# EAGLE design LPT2MIDI (EAGLE 9.5.2)
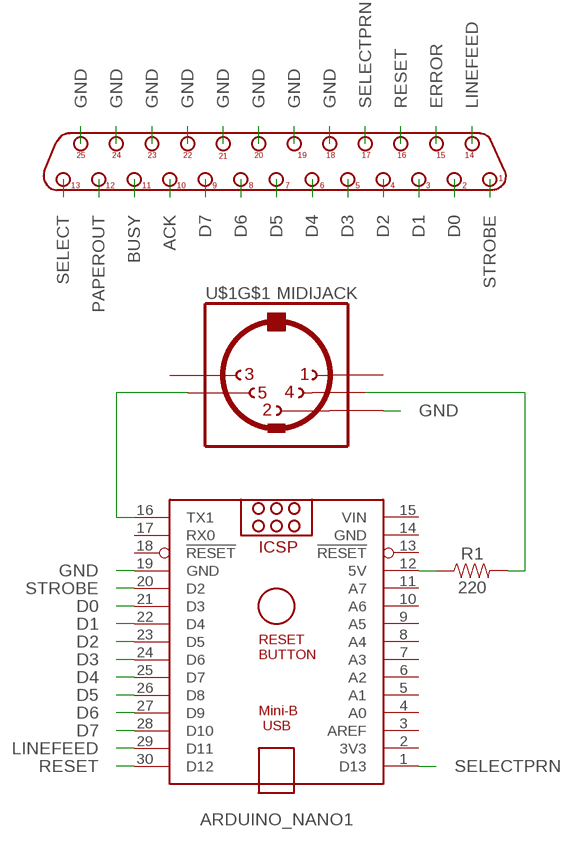
[diagram p0: schematic, sheet 1]

## Parts
ARDUINO_NANO1  ARDUINO_NANO  [ARDUINO_NANO]
CON1  DB25M/90  [D-25M/90]
R1  220  100OHM-HORIZ-1/4W-1%  [AXIAL-0.3]
U$1  MIDIJACK  [CP-2350]

## Nets
ACK: CON1.10
BUSY: CON1.11
D0: ARDUINO_NANO1.21(D3) CON1.2
D1: ARDUINO_NANO1.22(D4) CON1.3
D2: ARDUINO_NANO1.23(D5) CON1.4
D3: ARDUINO_NANO1.24(D6) CON1.5
D4: ARDUINO_NANO1.25(D7) CON1.6
D5: ARDUINO_NANO1.26(D8) CON1.7
D6: ARDUINO_NANO1.27(D9) CON1.8
D7: ARDUINO_NANO1.28(D10) CON1.9
ERROR: CON1.15
GND: ARDUINO_NANO1.19(GND) CON1.18 CON1.19 CON1.20 CON1.21 CON1.22 CON1.23 CON1.24 CON1.25 U$1.2
LINEFEED: ARDUINO_NANO1.29(D11) CON1.14
N$1: ARDUINO_NANO1.12(5V) R1.P$1
N$2: R1.P$2 U$1.4
N$3: ARDUINO_NANO1.16(TX1) U$1.5
PAPEROUT: CON1.12
RESET: ARDUINO_NANO1.30(D12) CON1.16
SELECT: CON1.13
SELECTPRN: ARDUINO_NANO1.1(D13) CON1.17
STROBE: ARDUINO_NANO1.20(D2) CON1.1
Unconnected: ARDUINO_NANO1.2(3V3) ARDUINO_NANO1.3(AREF) ARDUINO_NANO1.4(A0) ARDUINO_NANO1.5(A1) ARDUINO_NANO1.6(A2) ARDUINO_NANO1.7(A3) ARDUINO_NANO1.8(A4) ARDUINO_NANO1.9(A5) ARDUINO_NANO1.10(A6) ARDUINO_NANO1.11(A7) ARDUINO_NANO1.13(!RESET) ARDUINO_NANO1.17(RX0) ARDUINO_NANO1.18(!RESET) U$1.1 U$1.3 U$1.PE1(MT) U$1.PE2(MT) U$1.PE(MT) U$1.PE@(MT)

## Power pins joined to a net without a drawn wire
GND: ARDUINO_NANO1.14(GND)
VIN: ARDUINO_NANO1.15(VIN)

## Library data of the parts
ARDUINO_NANO1 = ArduinoNanoV30:ARDUINO_NANO: Arduino Nano V3.0 Overview: The Arduino Nano is a small, complete, and breadboard-friendly board based on the ATmega328 (Arduino Nano 3.x) or ATmega168 (Arduino Nano 2.x). It has more or less the same functionality of the Arduino Duemilanove, but in a different package. It lacks only a DC power jack, and works with a Mini-B USB cable instead of a standard one. The Nano was designed and is being produced by Gravitech. Specifications: Microcontroller Atmel ATmega168 or ATmega328 Operating Voltage (logic level) 5 V Input Voltage (recommended) 7-12 V Input Voltage (limits) 6-20 V Digital I/O Pins 14 (of which 6 provide PWM output) Analog Input Pins 8 DC Current per I/O Pin 40 mA Flash Memory 16 KB (ATmega168) or 32 KB (ATmega328) of which 2 KB used by bootloader SRAM 1 KB (ATmega168) or 2 KB (ATmega328) EEPROM 512 bytes (ATmega168) or 1 KB (ATmega328) Clock Speed 16 MHz Dimensions 0.73" x 1.70" Length 45 mm Width 18 mm Weigth 5 g Power: The Arduino Nano can be powered via the Mini-B USB connection, 6-20V unregulated external power supply (pin 30), or 5V regulated external power supply (pin 27). The power source is automatically selected to the highest voltage source. Memory: The ATmega168 has 16 KB of flash memory for storing code (of which 2 KB is used for the bootloader); the ATmega328 has 32 KB, (also with 2 KB used for the bootloader). The ATmega168 has 1 KB of SRAM and 512 bytes of EEPROM (which can be read and written with the EEPROM library); the ATmega328 has 2 KB of SRAM and 1 KB of EEPROM. Input and Output: Each of the 14 digital pins on the Nano can be used as an input or output, using pinMode(), digitalWrite(), and digitalRead() functions. They operate at 5 volts. Each pin can provide or receive a maximum of 40 mA and has an internal pull-up resistor (disconnected by default) of 20-50 kOhms. In addition, some pins have specialized functions. Visit Arduino - ArduinoBoardNano <https://www.arduino.cc/en/Main/ArduinoBoardNano>
CON1 = connect:DB25M/90
R1 = SparkFun-Resistors:100OHM: 100Ω resistor A resistor is a passive two-terminal electrical component that implements electrical resistance as a circuit element. Resistors act to reduce current flow, and, at the same time, act to lower voltage levels within circuits. - Wikipedia; PROD_ID: RES-12181; VALUE: 100
U$1 = adafruit:MIDIJACK: DIN 5 jack also known as MIDI jack A modification of conn-hirshman:MAB5SH with two options for the grounding 'teeth'

## Board
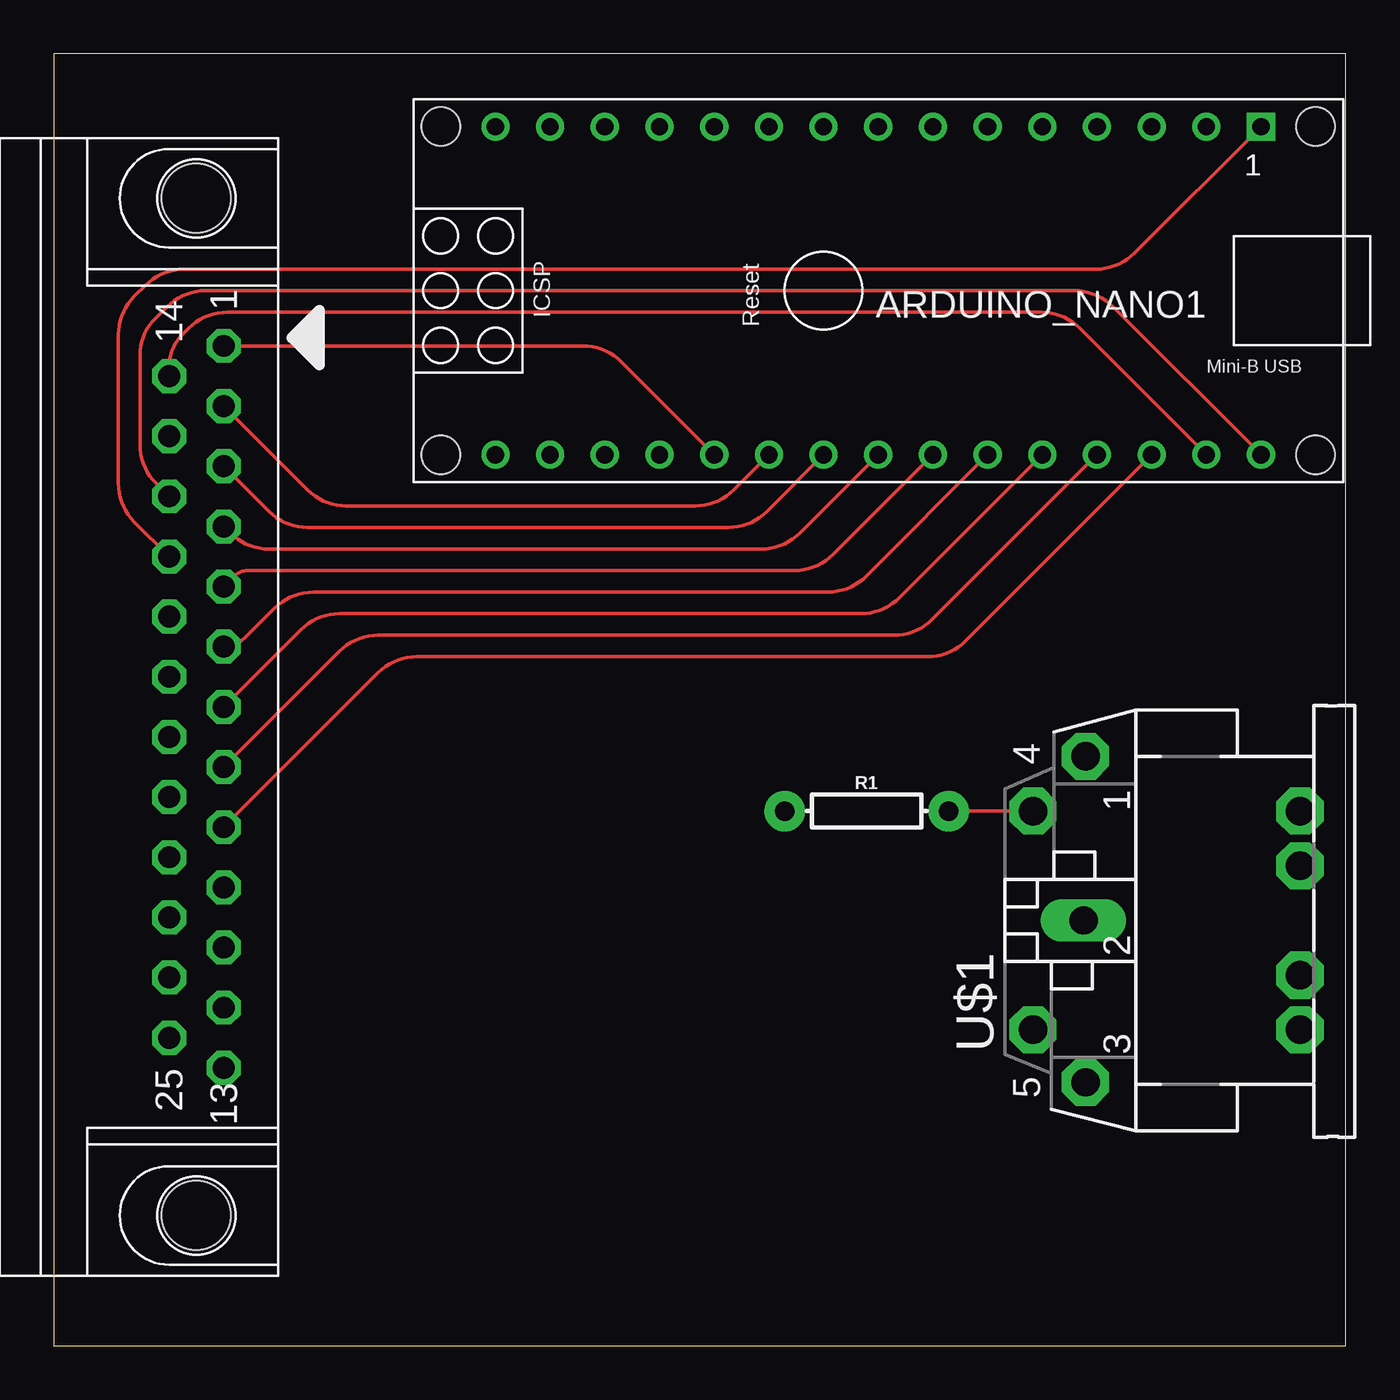
[diagram p1: board, top side]
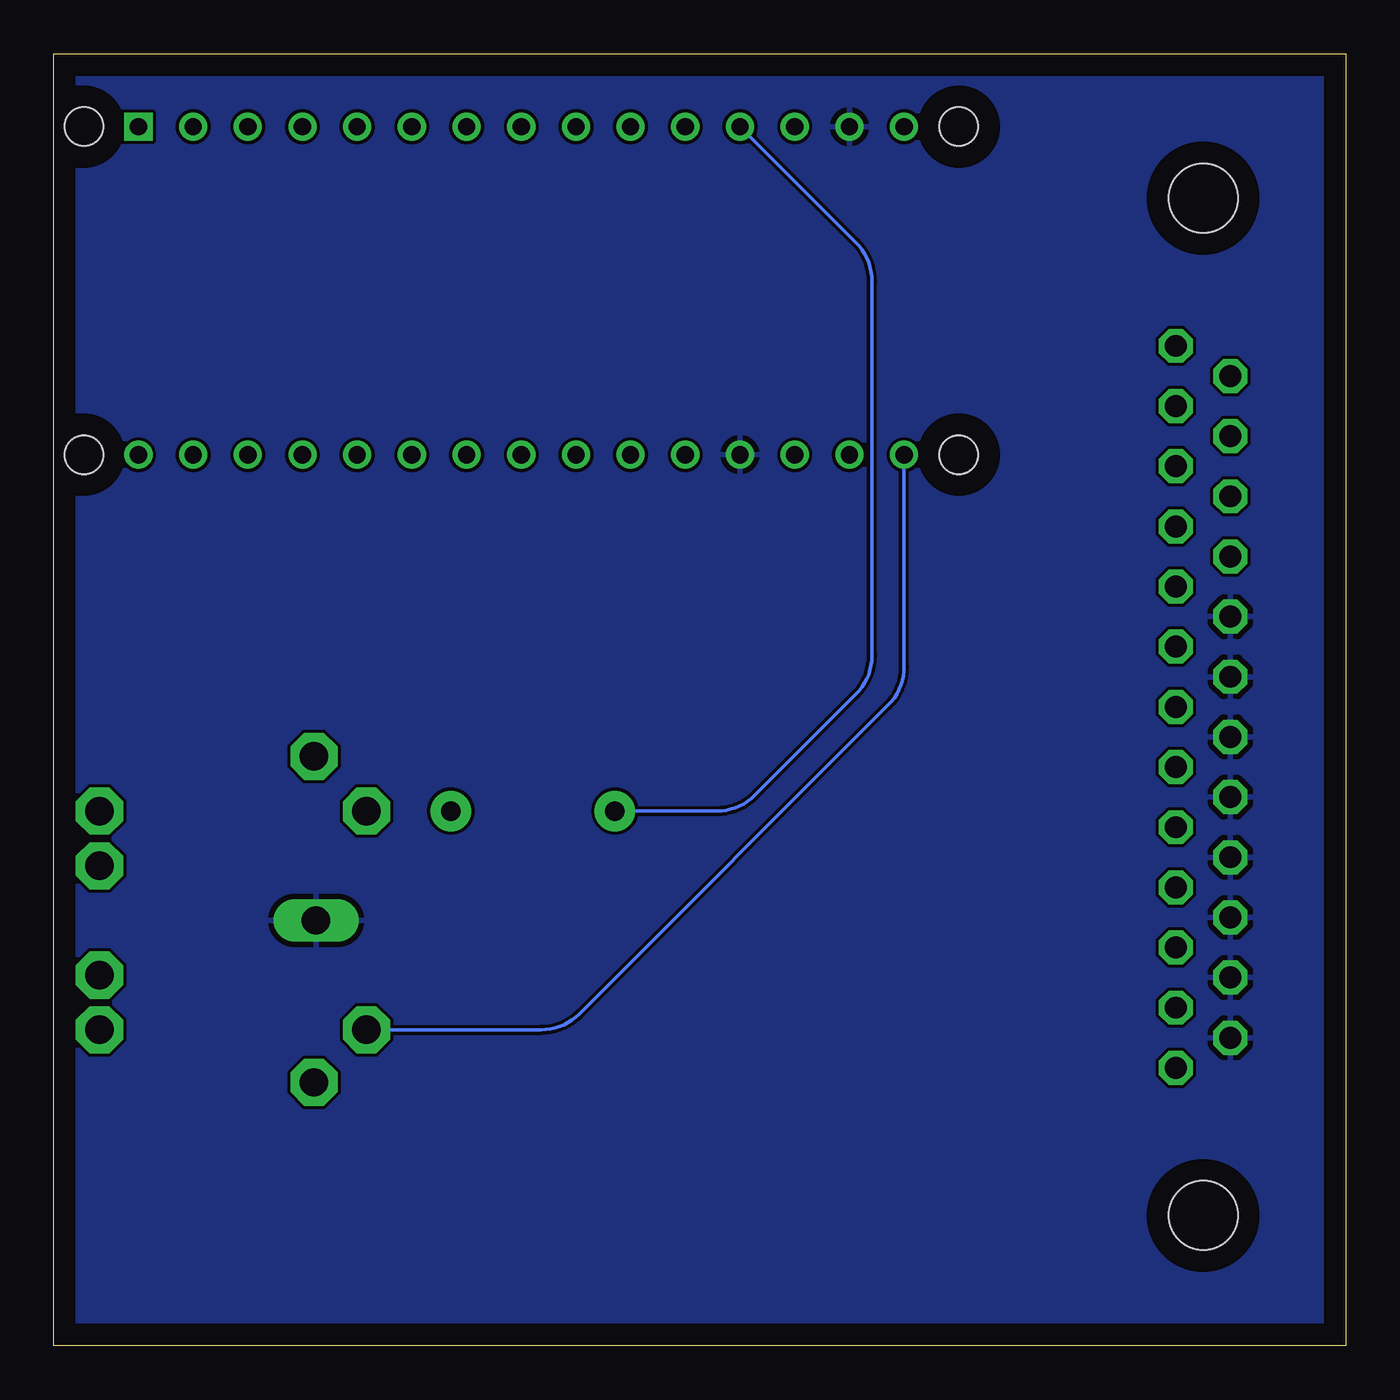
[diagram p2: board, bottom side, seen from below]

Size 60 x 60 mm. Coordinates in mm from the lower left corner, seen from the top.
Outline: 0,0 60,0 60,60 0,60 0,0
Copper layers (1*16): Top 0.035mm / dielectric 1.5mm / Bottom 0.035mm
Design rules "default": minimum track width 6mil, minimum drill 0.35mm, track to track 6mil, track to pad 6mil, pad to pad 6mil, via to via 6mil, smd to smd 6mil, copper to edge 40mil, drill to drill 6mil, minimum pad ring 10mil, minimum via ring 8mil, stop-mask expansion 4mil, vias tented up to drill 0mil, thermal gap 10mil

### Footprints (pad centres in the part's own frame; a part is rotated, then mirrored left to right if it is on the bottom)
ARDUINO_NANO = drill 0.8 square: 1 -20.32,-7.62 | drill 0.8: 2 -17.78,-7.62; 3 -15.24,-7.62; 4 -12.7,-7.62; 5 -10.16,-7.62; 6 -7.62,-7.62; 7 -5.08,-7.62; 8 -2.54,-7.62; 9 0,-7.62; 10 2.54,-7.62; 11 5.08,-7.62; 12 7.62,-7.62; 13 10.16,-7.62; 14 12.7,-7.62; 15 15.24,-7.62; 16 15.24,7.62; 17 12.7,7.62; 18 10.16,7.62; 19 7.62,7.62; 20 5.08,7.62; 21 2.54,7.62; 22 0,7.62; 23 -2.54,7.62; 24 -5.08,7.62; 25 -7.62,7.62; 26 -10.16,7.62; 27 -12.7,7.62; 28 -15.24,7.62; 29 -17.78,7.62; 30 -20.32,7.62 | hole 1.778: -22.86,-7.62; -22.86,7.62; 17.78,7.62; 17.78,-7.62
D-25M/90 = drill 1.016 pad 1.575 octagon: 1 16.764,-1.27; 2 13.97,-1.27; 3 11.176,-1.27; 4 8.382,-1.27; 5 5.588,-1.27; 6 2.794,-1.27; 7 0,-1.27; 8 -2.794,-1.27; 9 -5.588,-1.27; 10 -8.382,-1.27; 11 -11.176,-1.27; 12 -13.97,-1.27; 13 -16.764,-1.27; 14 15.367,1.27; 15 12.573,1.27; 16 9.779,1.27; 17 6.985,1.27; 18 4.191,1.27; 19 1.397,1.27; 20 -1.397,1.27; 21 -4.191,1.27; 22 -6.985,1.27; 23 -9.779,1.27; 24 -12.573,1.27; 25 -15.367,1.27 | hole 3.2: 23.622,0; -23.622,0
AXIAL-0.3 = drill 0.9 pad 1.88: P$1 -3.81,0; P$2 3.81,0
CP-2350 = drill 1.321 pad 2.184 octagon: 1 7.62,12.58; 3 -7.52,12.58; 4 5.08,15.02; 5 -5.08,15.02; PE -2.54,2.62; PE1 -5.08,2.62; PE2 5.08,2.62; PE@ 2.54,2.62 | drill 1.321 long: 2 0,12.68

### Placement (x,y rotation side)
ARDUINO_NANO1  35.75,49 180 top
CON1  6.62,29.67 90 top
R1  37.75,24.83 0 top
U$1  60.5,19.75 90 top

### Tracks (layer width: path | path; a pad name or v marks a point on that pad's centre or on a via)
D0
  Top 0.152: CON1.2 11.79,39.74 arc45 13.58,39 29.78,39 arc45 31.57,39.74 ARDUINO_NANO1.21
D1
  Top 0.152: CON1.3 9.99,38.74 arc45 11.79,38 31.32,38 arc45 33.11,38.74 ARDUINO_NANO1.22
D2
  Top 0.152: CON1.4 8.2,37.74 arc45 9.99,37 32.86,37 arc45 34.65,37.74 ARDUINO_NANO1.23
D3
  Top 0.152: CON1.5 8.37,35.74 arc-45 9,36 34.4,36 arc45 36.19,36.74 ARDUINO_NANO1.24
D4
  Top 0.152: CON1.6 arc45 8.87,32.87 10.26,34.26 arc-45 12.05,35 35.94,35 arc45 37.73,35.74 ARDUINO_NANO1.25
D5
  Top 0.152: CON1.7 11.48,33.26 arc-45 13.27,34 37.48,34 arc45 39.27,34.74 ARDUINO_NANO1.26
D6
  Top 0.152: CON1.8 13.27,32.26 arc-45 15.07,33 39.02,33 arc45 40.81,33.74 ARDUINO_NANO1.27
D7
  Top 0.152: CON1.9 15.06,31.26 arc-45 16.86,32 40.56,32 arc45 42.35,32.74 ARDUINO_NANO1.28
GND
  pour Bottom: 0,0 60,0 60,60 0,60
LINEFEED
  Top 0.152: CON1.14 5.35,45.43 arc-45 6,47 6.26,47.26 arc-45 8.05,48 45.86,48 arc-45 47.65,47.26 ARDUINO_NANO1.29
N$1
  Bottom 0.152: ARDUINO_NANO1.12 22.74,51.23 arc45 22,49.44 22,32.05 arc45 22.74,30.26 27.43,25.57 arc45 29.22,24.83 R1.P$1
N$2
  Top 0.152: R1.P$2 U$1.4
N$3
  Bottom 0.152: U$1.5 37.38,14.67 arc-45 35.59,15.41 21.25,29.75 arc-45 20.51,31.54 ARDUINO_NANO1.16
RESET
  Top 0.152: CON1.16 4.74,40.05 arc-45 4,41.85 4,46 arc-45 4.71,47.71 5.26,48.26 arc-45 7.05,49 47.4,49 arc-45 49.19,48.26 ARDUINO_NANO1.30
SELECTPRN
  Top 0.152: CON1.17 3.74,38.26 arc-45 3,40.06 3,46.95 arc-45 3.74,48.74 4.26,49.26 arc-45 6.05,50 48.4,50 arc45 50.19,50.74 ARDUINO_NANO1.1
STROBE
  Top 0.152: CON1.1 24.56,46.43 arc-45 26.36,45.69 ARDUINO_NANO1.20